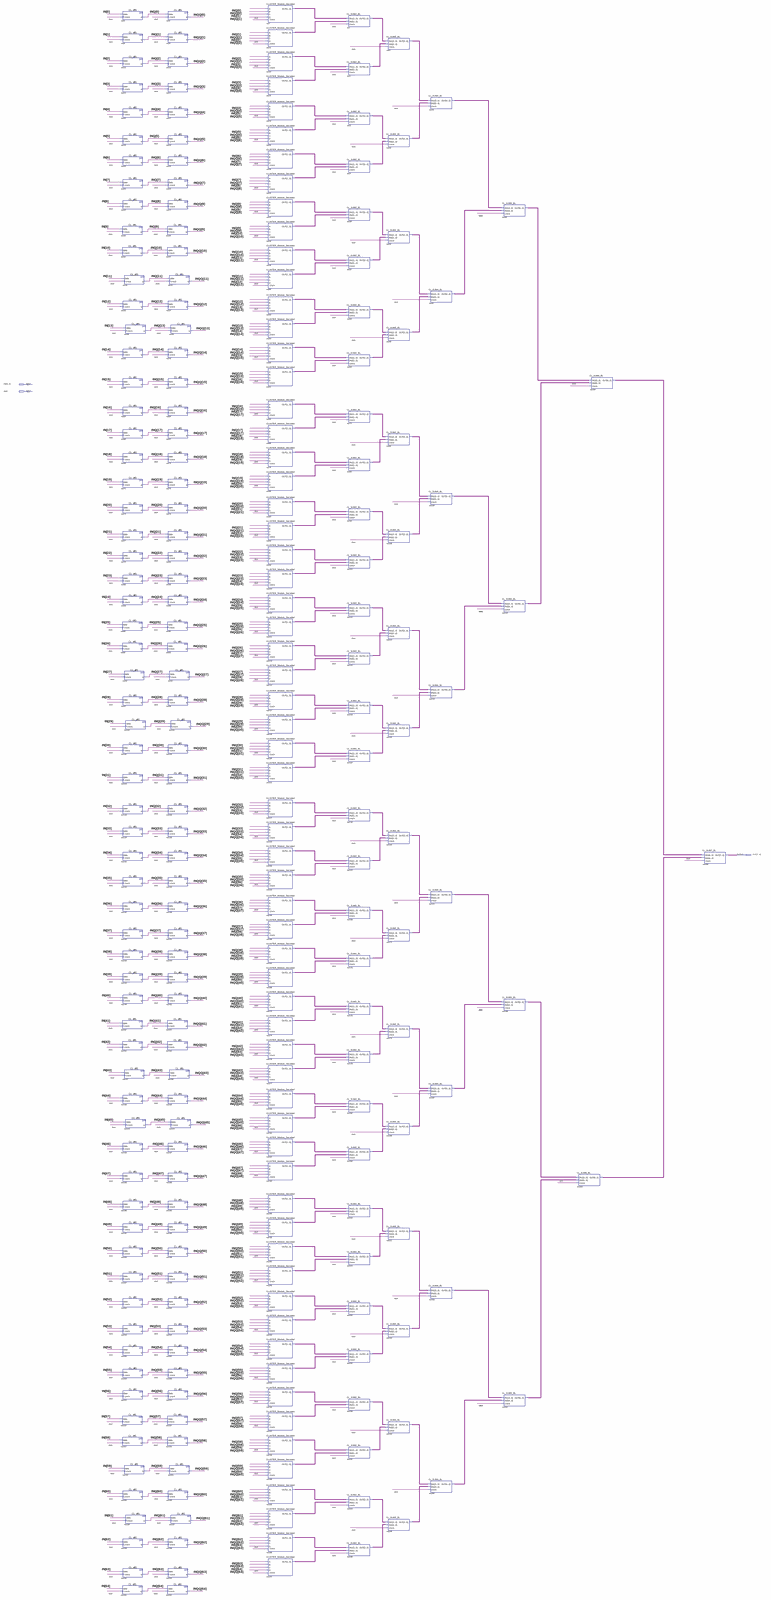
[diagram p0: schematic sheet, whole]
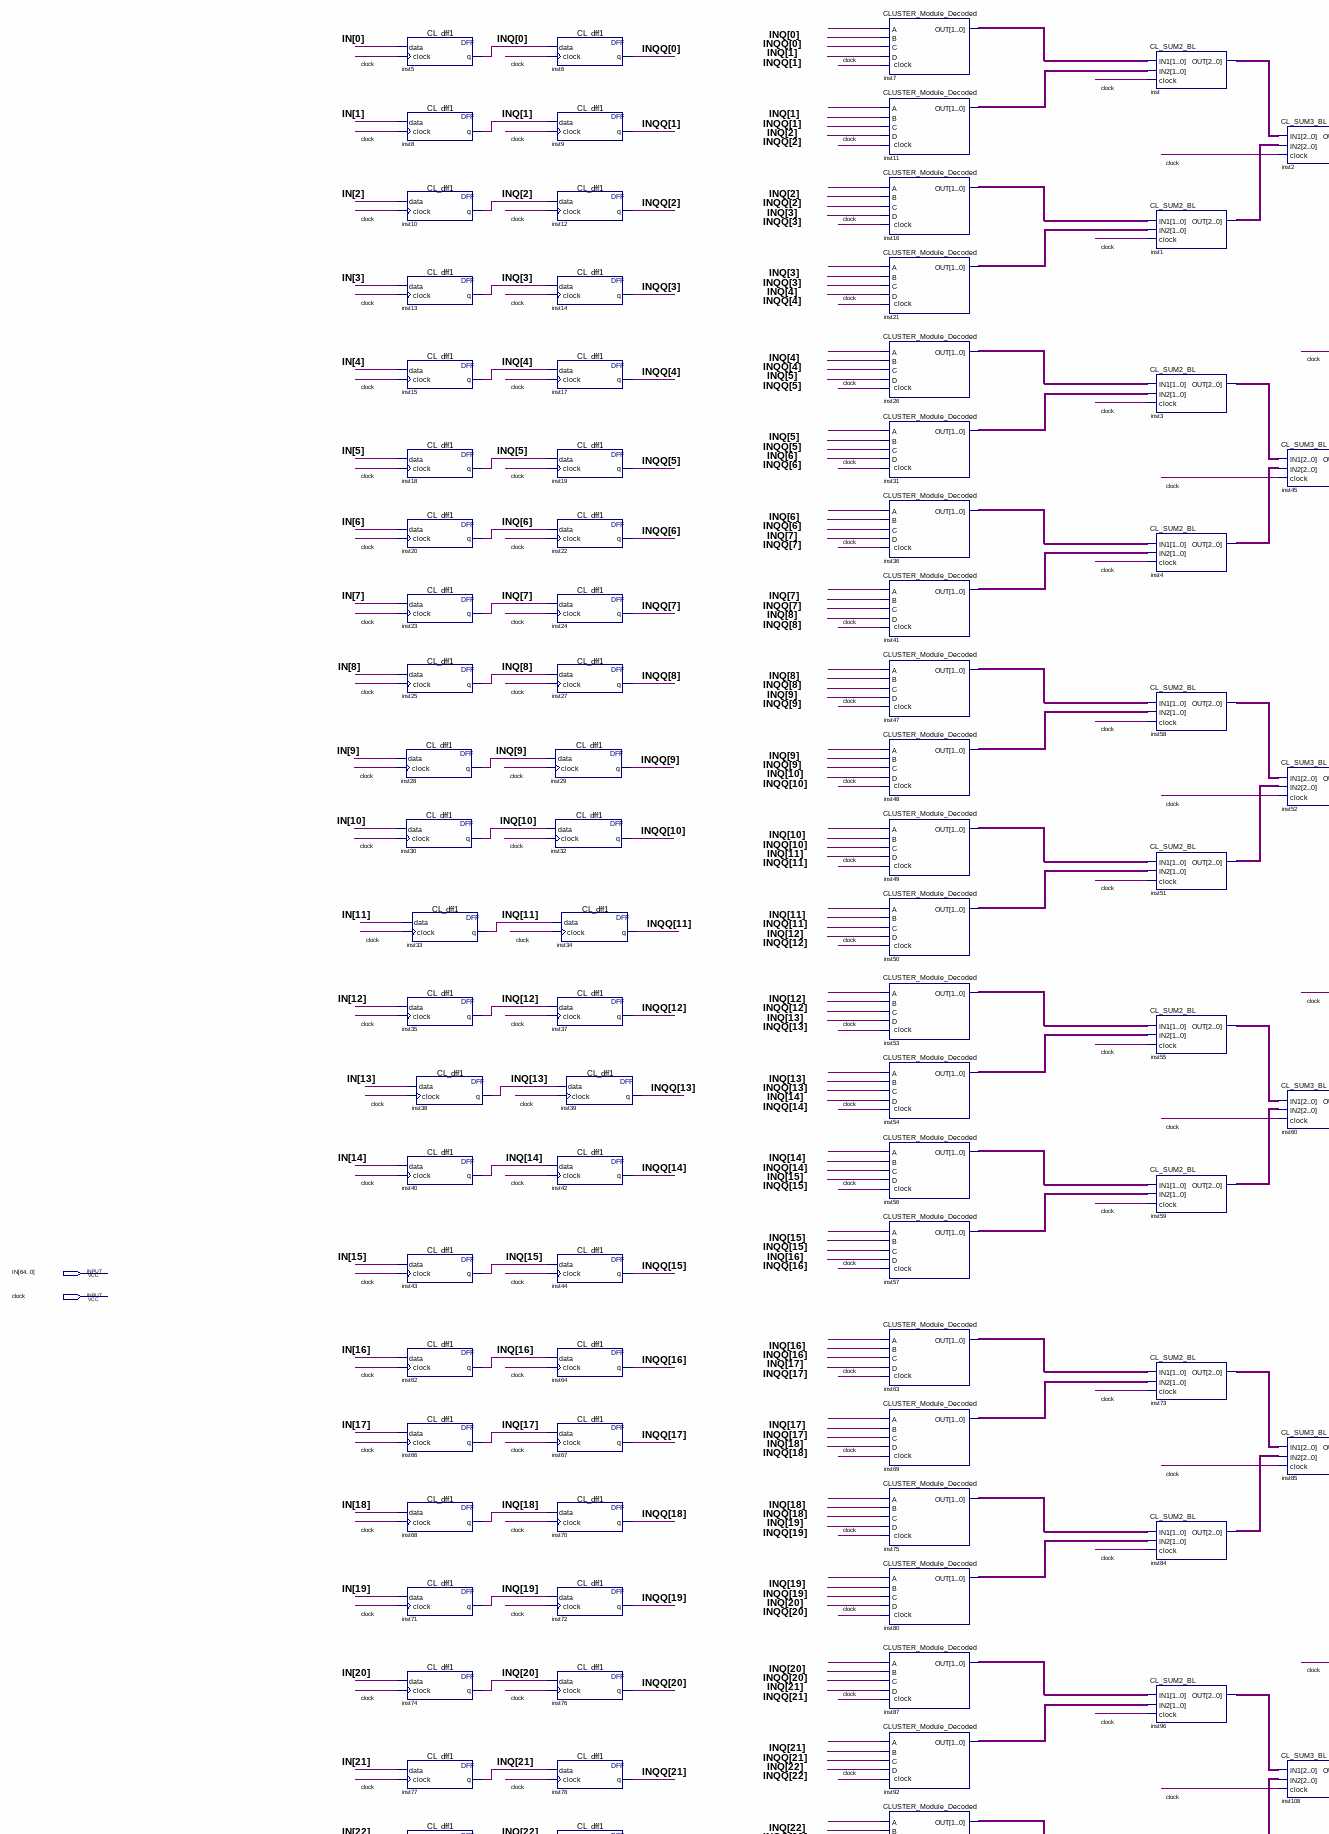
[diagram p1: schematic sheet, upper left part]
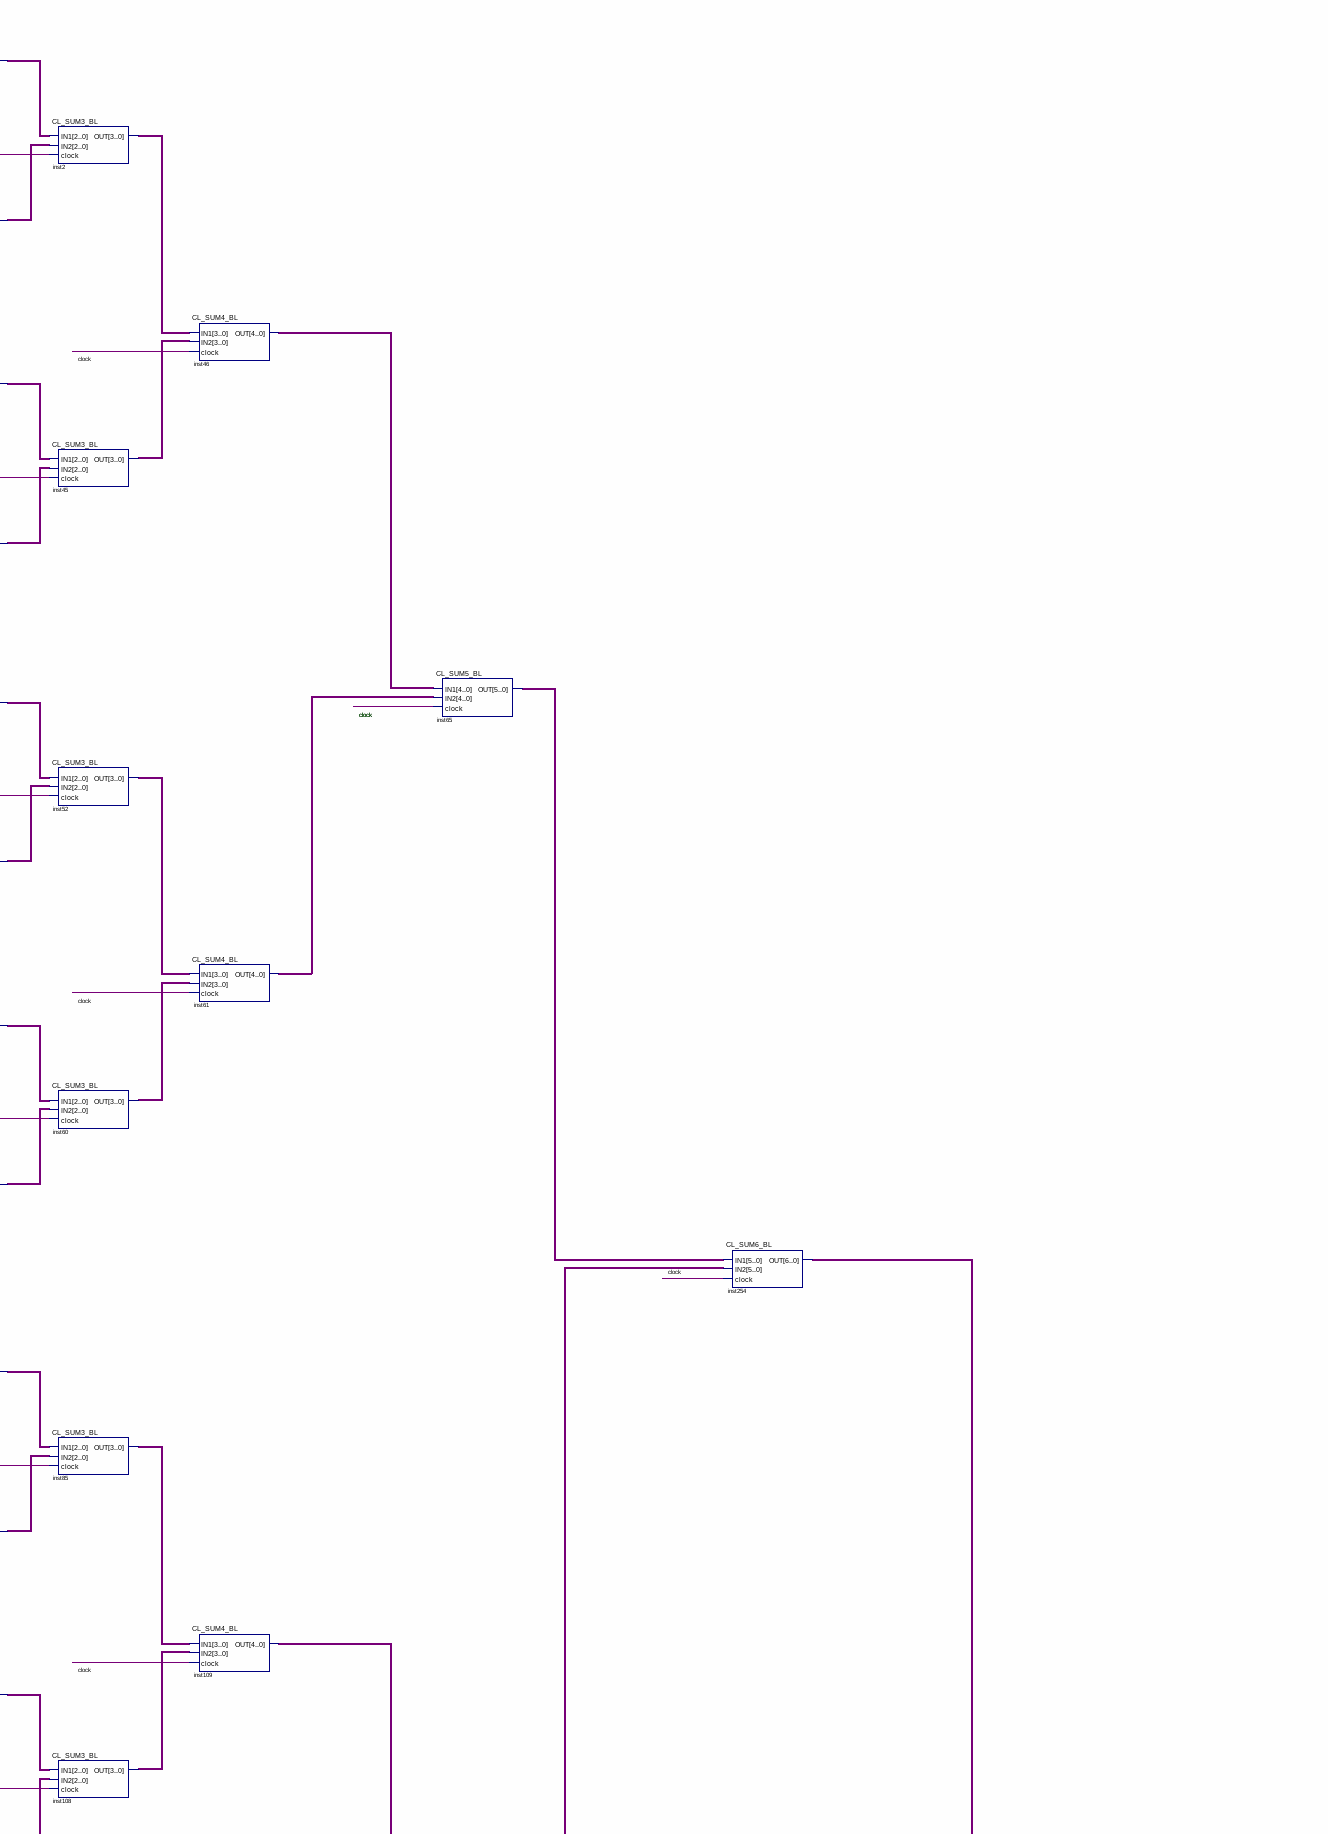
[diagram p2: schematic sheet, upper right part]
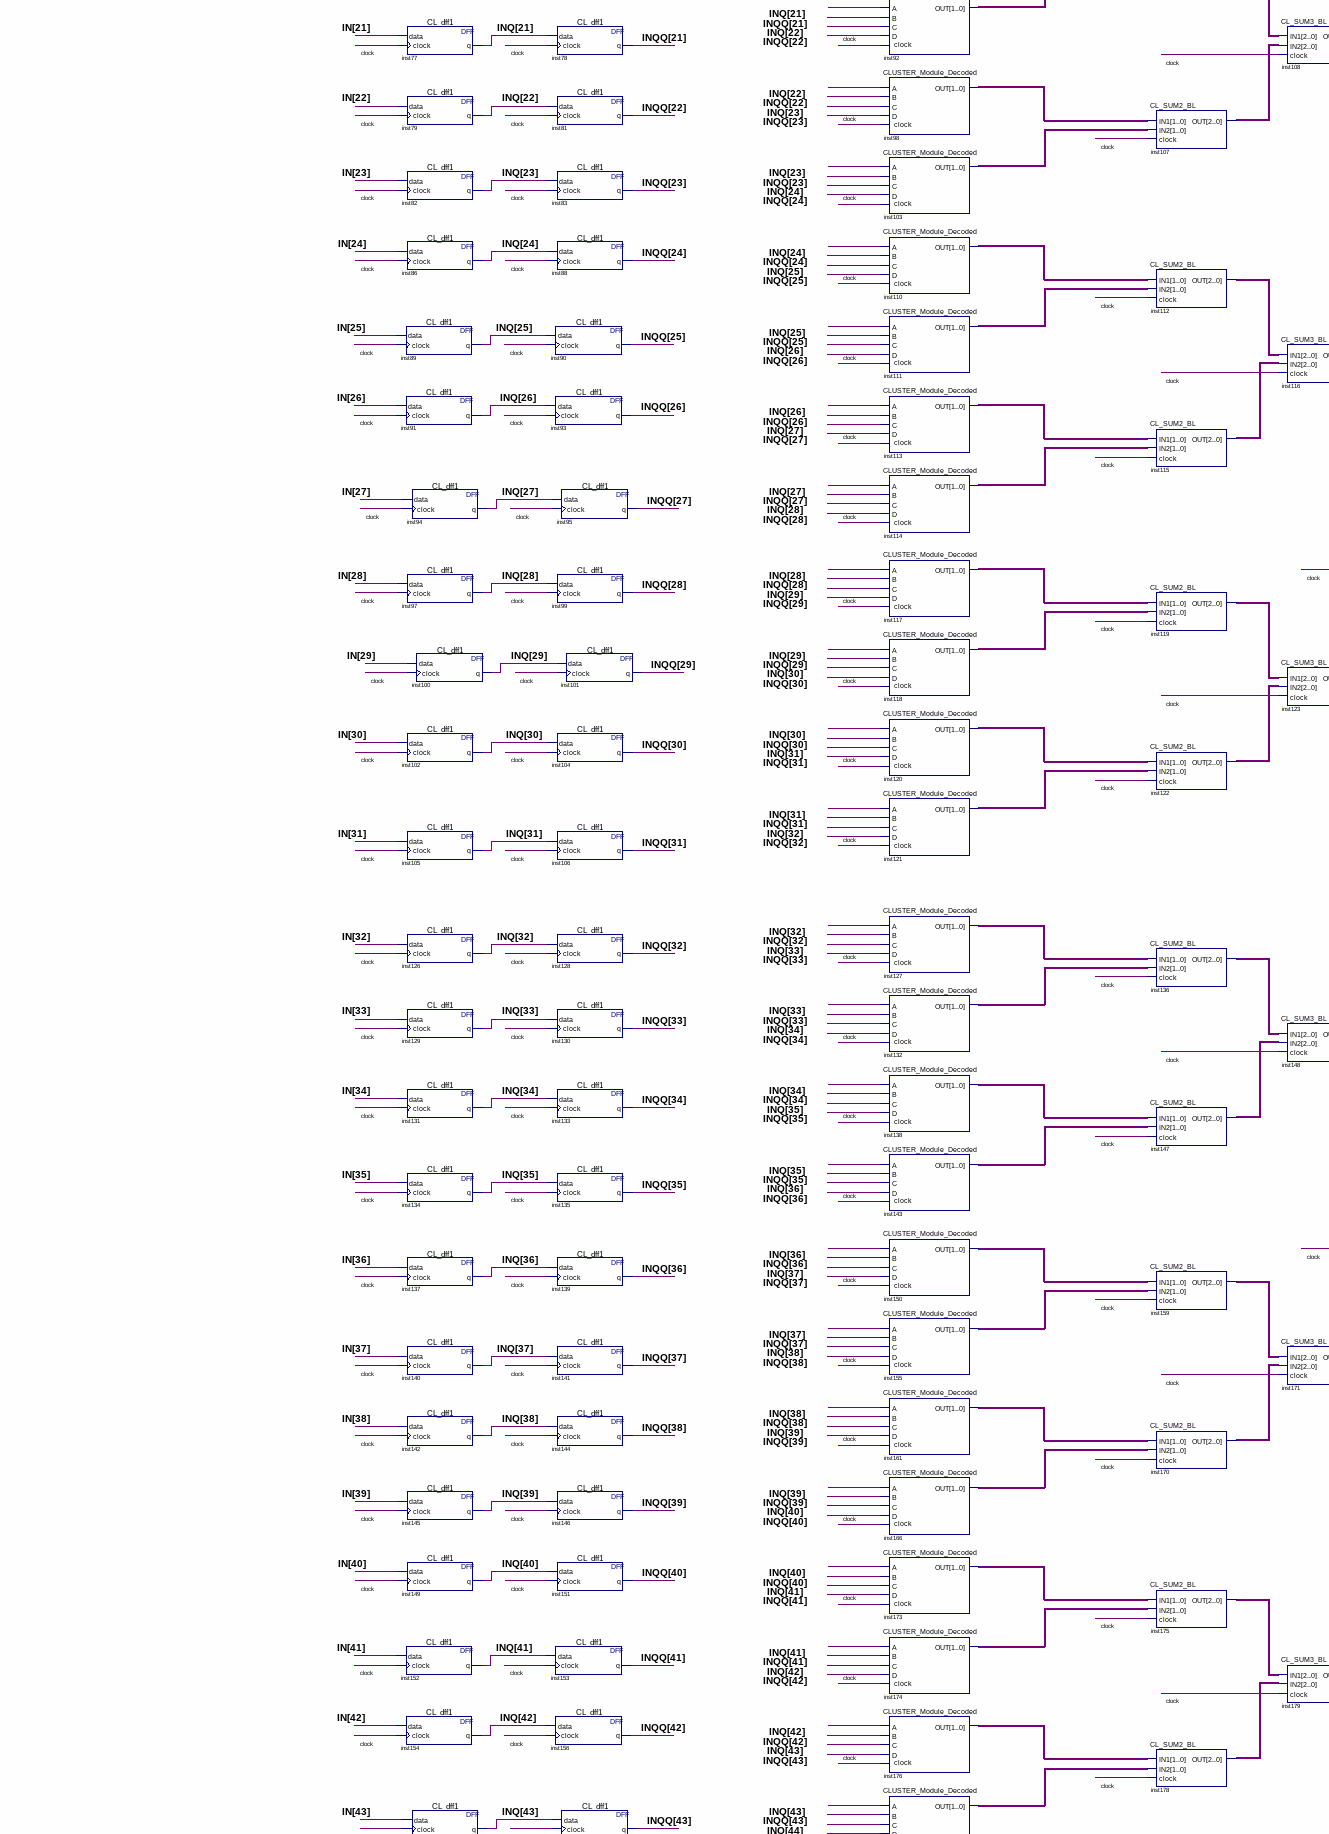
[diagram p3: schematic sheet, middle left part]
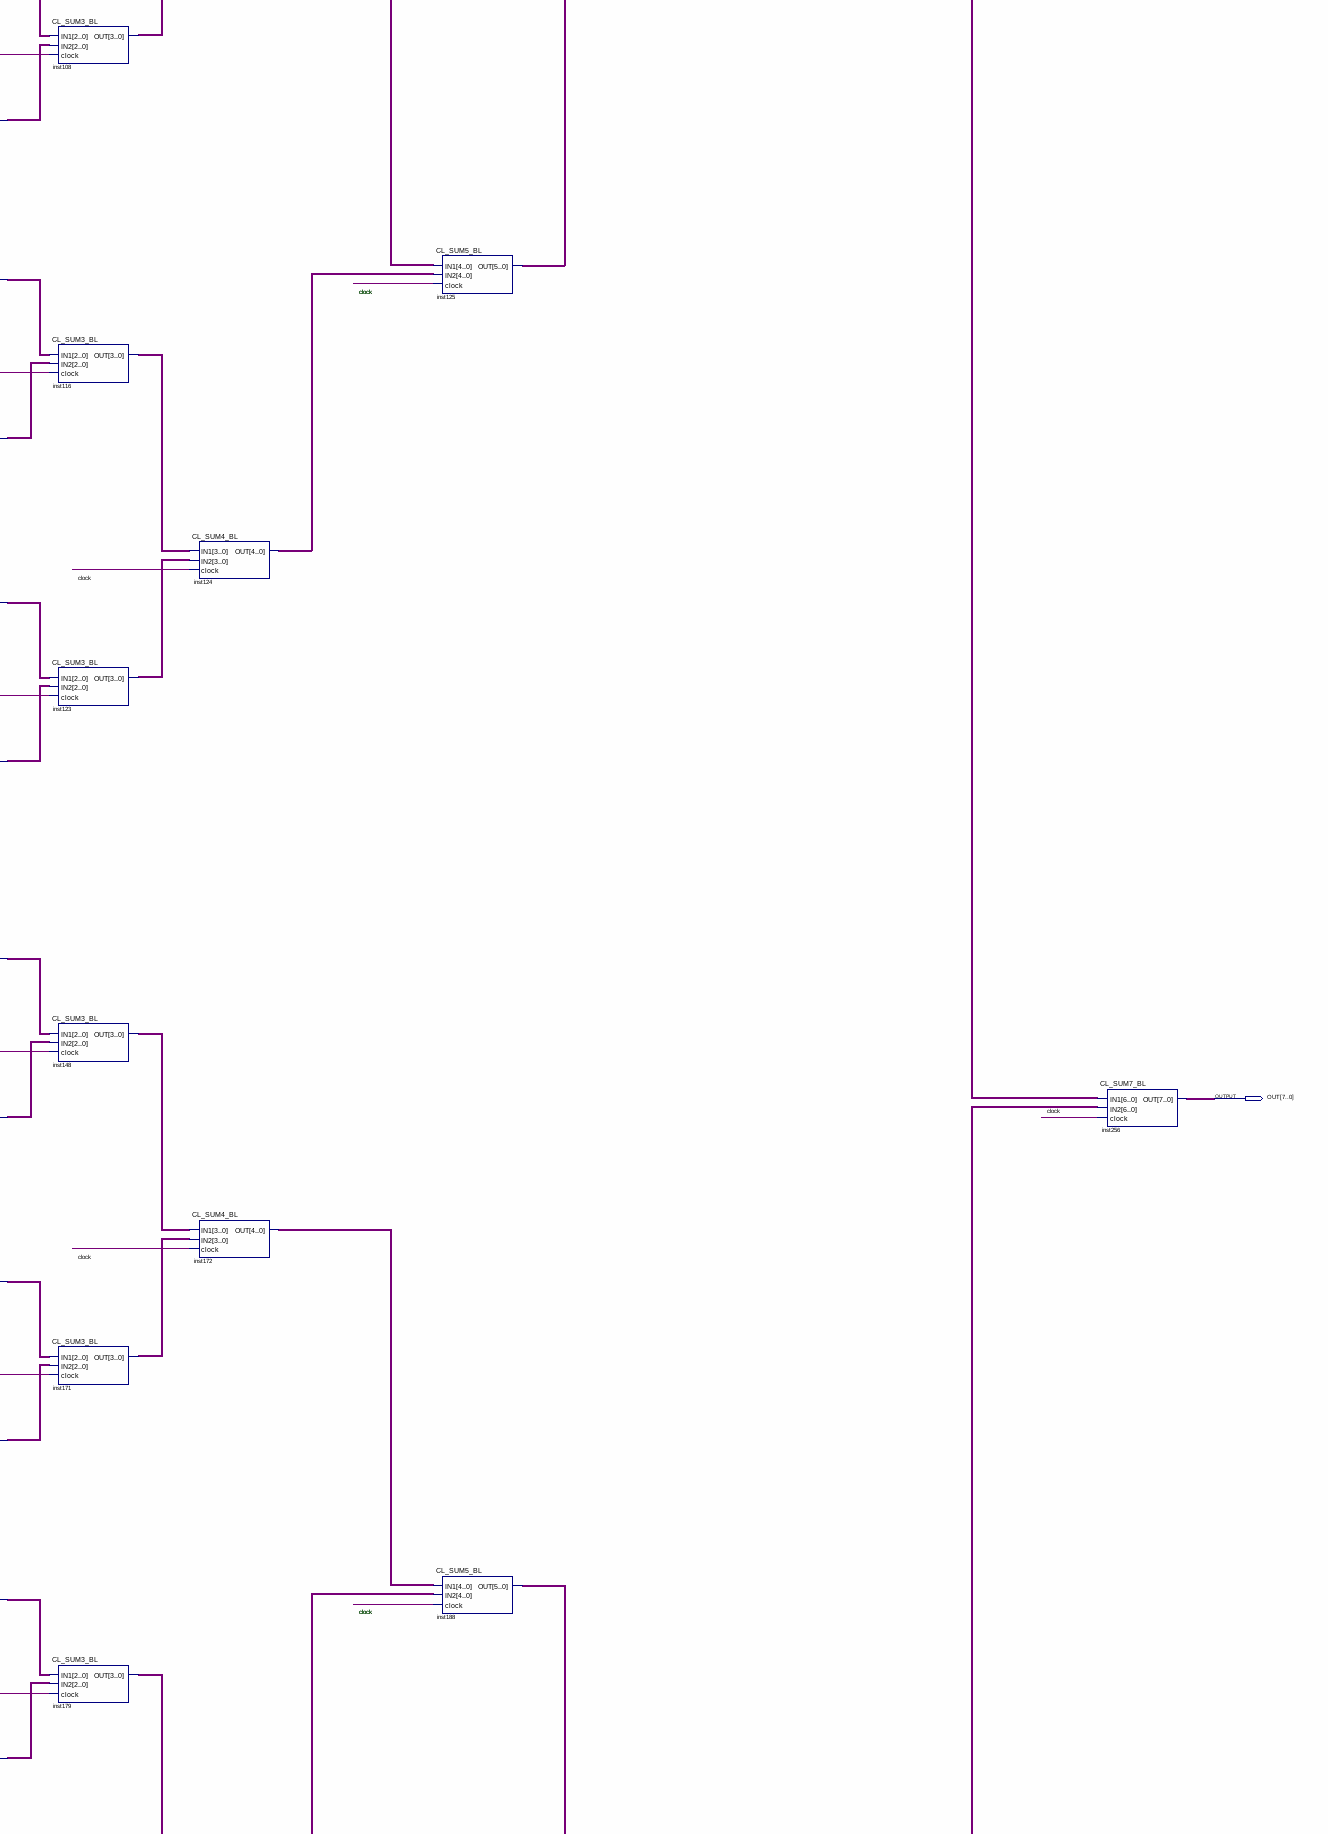
[diagram p4: schematic sheet, middle right part]
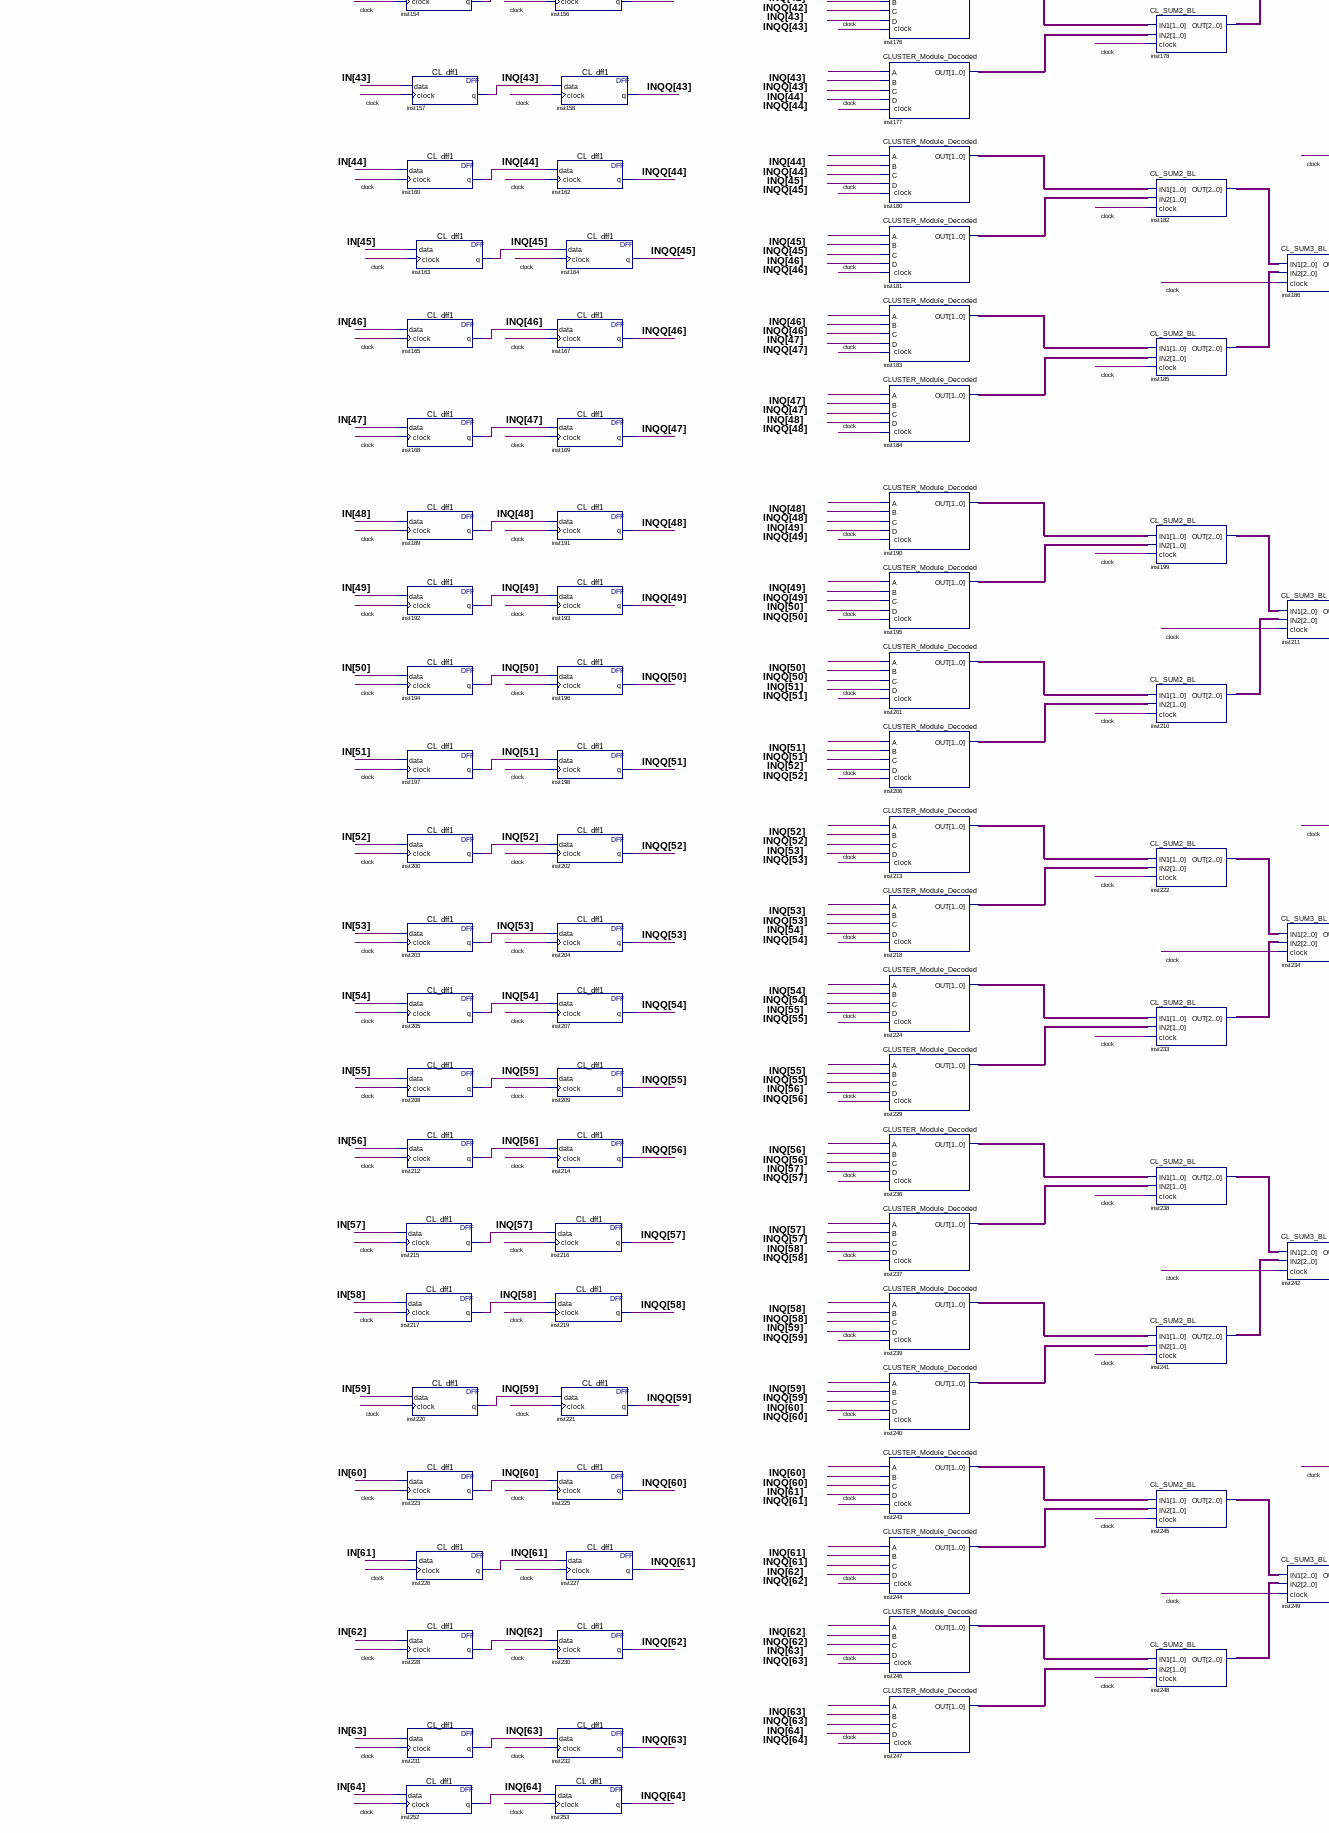
[diagram p5: schematic sheet, lower left part]
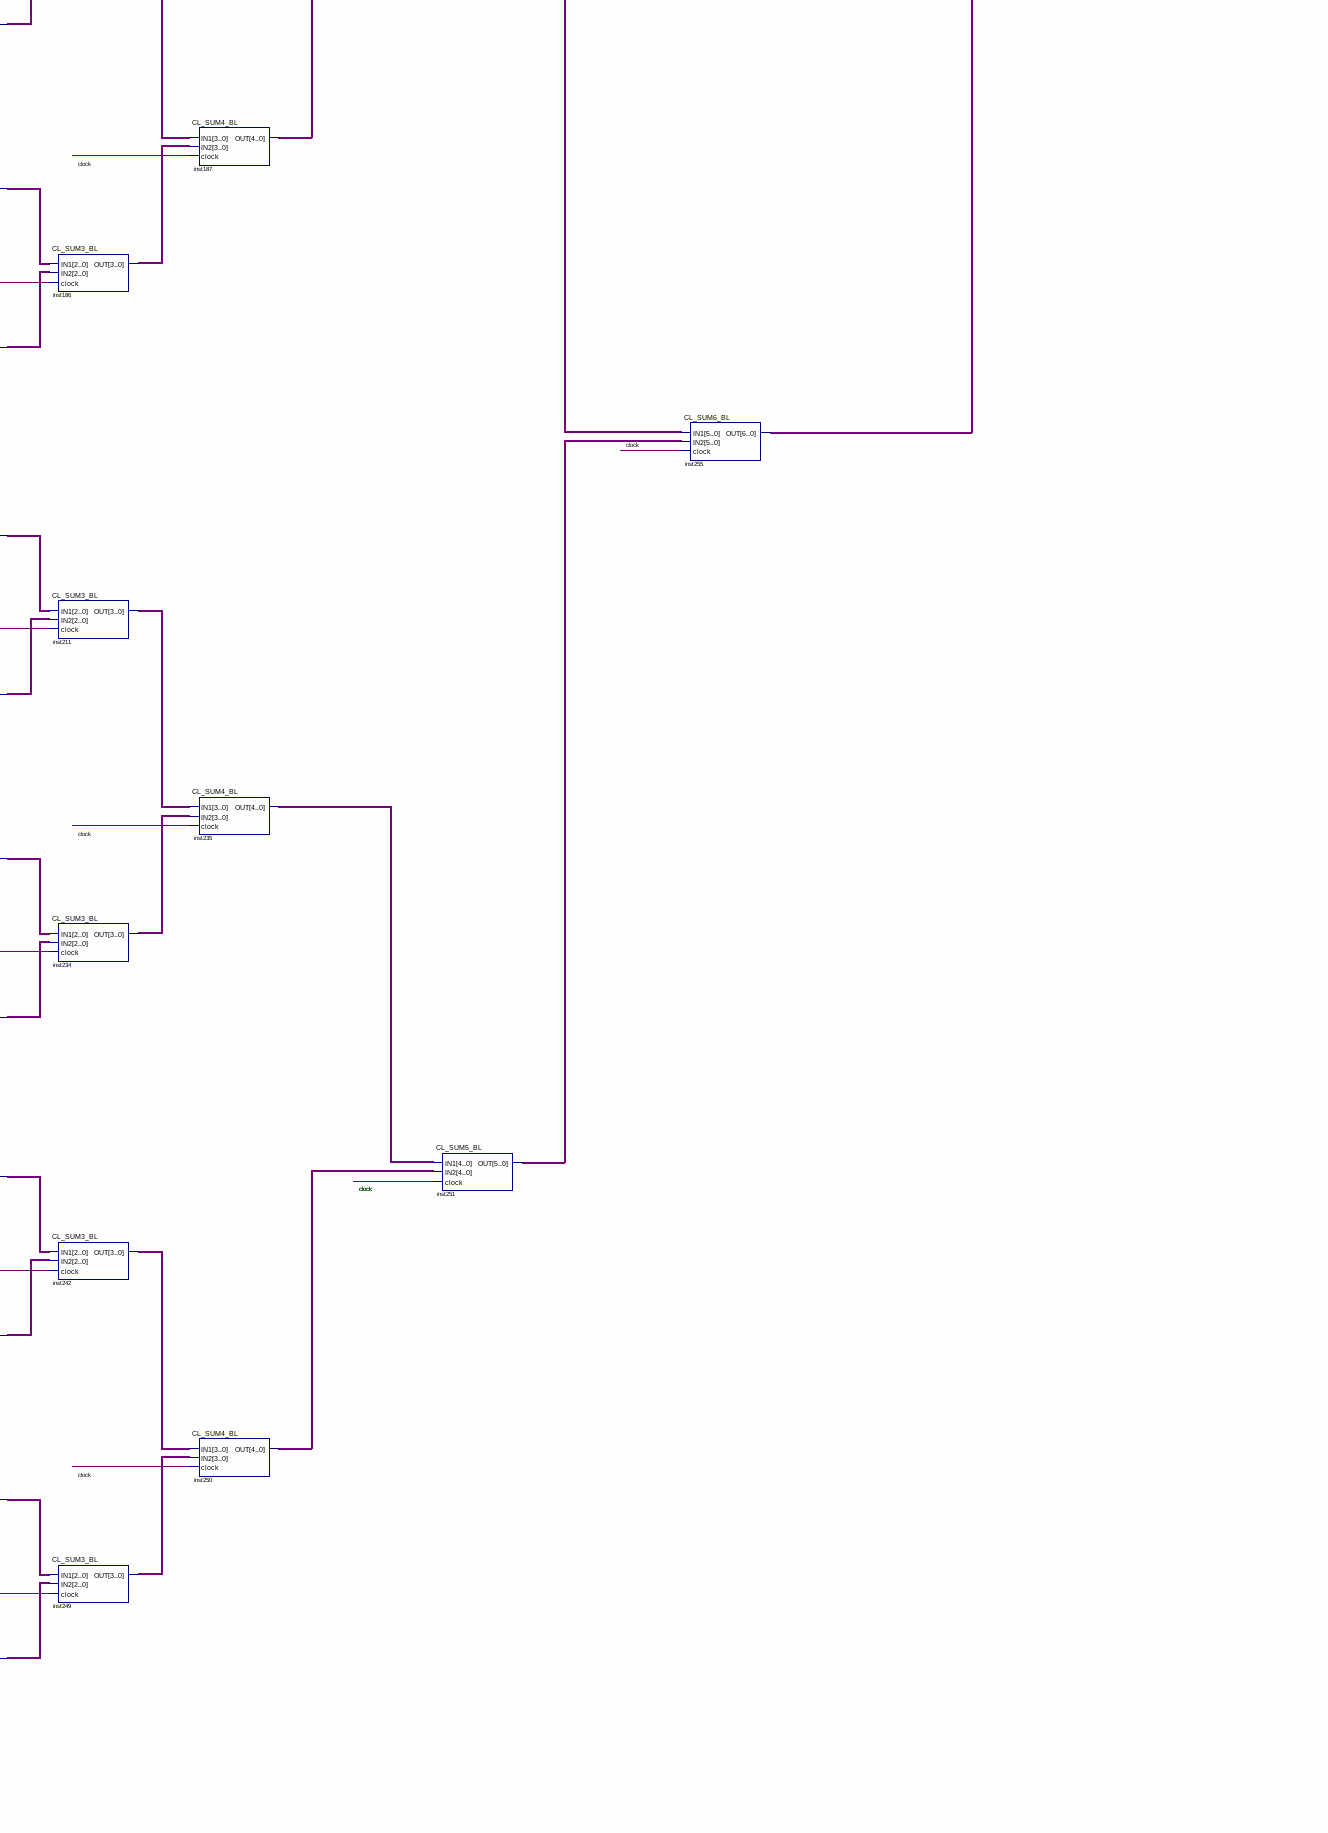
[diagram p6: schematic sheet, lower right part]
// Quartus schematic CL_ClusterCounter_64.bdf as structural Verilog: 257 symbols, 3 pins
module CL_ClusterCounter_64 (
  input  [64:0] IN,
  input  clock,
  output [7:0] OUT
);

  wire [1:0] inst7_out, inst11_out, inst16_out, inst21_out, inst26_out, inst31_out, inst36_out, inst41_out,
       inst47_out, inst48_out, inst49_out, inst50_out, inst53_out, inst54_out, inst56_out, inst57_out,
       inst63_out, inst69_out, inst75_out, inst80_out, inst87_out, inst92_out, inst98_out, inst103_out,
       inst110_out, inst111_out, inst113_out, inst114_out, inst117_out, inst118_out, inst120_out,
       inst121_out, inst127_out, inst132_out, inst138_out, inst143_out, inst150_out, inst155_out,
       inst161_out, inst166_out, inst173_out, inst174_out, inst176_out, inst177_out, inst180_out,
       inst181_out, inst183_out, inst184_out, inst190_out, inst195_out, inst201_out, inst206_out,
       inst213_out, inst218_out, inst224_out, inst229_out, inst236_out, inst237_out, inst239_out,
       inst240_out, inst243_out, inst244_out, inst246_out, inst247_out;
  wire [2:0] inst1_out, inst3_out, inst4_out, inst51_out, inst55_out, inst58_out, inst59_out, inst73_out,
       inst84_out, inst96_out, inst107_out, inst112_out, inst115_out, inst119_out, inst122_out, inst136_out,
       inst147_out, inst159_out, inst170_out, inst175_out, inst178_out, inst182_out, inst185_out,
       inst199_out, inst210_out, inst222_out, inst233_out, inst238_out, inst241_out, inst245_out,
       inst248_out, inst_out;
  wire [3:0] inst2_out, inst45_out, inst52_out, inst60_out, inst85_out, inst108_out, inst116_out,
       inst123_out, inst148_out, inst171_out, inst179_out, inst186_out, inst211_out, inst234_out,
       inst242_out, inst249_out;
  wire [4:0] inst46_out, inst61_out, inst109_out, inst124_out, inst172_out, inst187_out, inst235_out,
       inst250_out;
  wire [5:0] inst65_out, inst125_out, inst188_out, inst251_out;
  wire [6:0] inst254_out, inst255_out;
  wire [64:0] INQ, INQQ;

  CL_dff1 inst28 (.data(IN[9]), .clock(clock), .q(INQ[9]));
  CL_dff1 inst30 (.data(IN[10]), .clock(clock), .q(INQ[10]));
  CL_dff1 inst89 (.data(IN[25]), .clock(clock), .q(INQ[25]));
  CL_dff1 inst91 (.data(IN[26]), .clock(clock), .q(INQ[26]));
  CL_dff1 inst152 (.data(IN[41]), .clock(clock), .q(INQ[41]));
  CL_dff1 inst154 (.data(IN[42]), .clock(clock), .q(INQ[42]));
  CL_dff1 inst215 (.data(IN[57]), .clock(clock), .q(INQ[57]));
  CL_dff1 inst217 (.data(IN[58]), .clock(clock), .q(INQ[58]));
  CL_dff1 inst252 (.data(IN[64]), .clock(clock), .q(INQ[64]));
  CL_dff1 inst5 (.data(IN[0]), .clock(clock), .q(INQ[0]));
  CL_dff1 inst8 (.data(IN[1]), .clock(clock), .q(INQ[1]));
  CL_dff1 inst10 (.data(IN[2]), .clock(clock), .q(INQ[2]));
  CL_dff1 inst13 (.data(IN[3]), .clock(clock), .q(INQ[3]));
  CL_dff1 inst15 (.data(IN[4]), .clock(clock), .q(INQ[4]));
  CL_dff1 inst18 (.data(IN[5]), .clock(clock), .q(INQ[5]));
  CL_dff1 inst20 (.data(IN[6]), .clock(clock), .q(INQ[6]));
  CL_dff1 inst23 (.data(IN[7]), .clock(clock), .q(INQ[7]));
  CL_dff1 inst25 (.data(IN[8]), .clock(clock), .q(INQ[8]));
  CL_dff1 inst33 (.data(IN[11]), .clock(clock), .q(INQ[11]));
  CL_dff1 inst35 (.data(IN[12]), .clock(clock), .q(INQ[12]));
  CL_dff1 inst38 (.data(IN[13]), .clock(clock), .q(INQ[13]));
  CL_dff1 inst40 (.data(IN[14]), .clock(clock), .q(INQ[14]));
  CL_dff1 inst43 (.data(IN[15]), .clock(clock), .q(INQ[15]));
  CL_dff1 inst62 (.data(IN[16]), .clock(clock), .q(INQ[16]));
  CL_dff1 inst66 (.data(IN[17]), .clock(clock), .q(INQ[17]));
  CL_dff1 inst68 (.data(IN[18]), .clock(clock), .q(INQ[18]));
  CL_dff1 inst71 (.data(IN[19]), .clock(clock), .q(INQ[19]));
  CL_dff1 inst74 (.data(IN[20]), .clock(clock), .q(INQ[20]));
  CL_dff1 inst77 (.data(IN[21]), .clock(clock), .q(INQ[21]));
  CL_dff1 inst79 (.data(IN[22]), .clock(clock), .q(INQ[22]));
  CL_dff1 inst82 (.data(IN[23]), .clock(clock), .q(INQ[23]));
  CL_dff1 inst86 (.data(IN[24]), .clock(clock), .q(INQ[24]));
  CL_dff1 inst94 (.data(IN[27]), .clock(clock), .q(INQ[27]));
  CL_dff1 inst97 (.data(IN[28]), .clock(clock), .q(INQ[28]));
  CL_dff1 inst100 (.data(IN[29]), .clock(clock), .q(INQ[29]));
  CL_dff1 inst102 (.data(IN[30]), .clock(clock), .q(INQ[30]));
  CL_dff1 inst105 (.data(IN[31]), .clock(clock), .q(INQ[31]));
  CL_dff1 inst126 (.data(IN[32]), .clock(clock), .q(INQ[32]));
  CL_dff1 inst129 (.data(IN[33]), .clock(clock), .q(INQ[33]));
  CL_dff1 inst131 (.data(IN[34]), .clock(clock), .q(INQ[34]));
  CL_dff1 inst134 (.data(IN[35]), .clock(clock), .q(INQ[35]));
  CL_dff1 inst137 (.data(IN[36]), .clock(clock), .q(INQ[36]));
  CL_dff1 inst140 (.data(IN[37]), .clock(clock), .q(INQ[37]));
  CL_dff1 inst142 (.data(IN[38]), .clock(clock), .q(INQ[38]));
  CL_dff1 inst145 (.data(IN[39]), .clock(clock), .q(INQ[39]));
  CL_dff1 inst149 (.data(IN[40]), .clock(clock), .q(INQ[40]));
  CL_dff1 inst157 (.data(IN[43]), .clock(clock), .q(INQ[43]));
  CL_dff1 inst160 (.data(IN[44]), .clock(clock), .q(INQ[44]));
  CL_dff1 inst163 (.data(IN[45]), .clock(clock), .q(INQ[45]));
  CL_dff1 inst165 (.data(IN[46]), .clock(clock), .q(INQ[46]));
  CL_dff1 inst168 (.data(IN[47]), .clock(clock), .q(INQ[47]));
  CL_dff1 inst189 (.data(IN[48]), .clock(clock), .q(INQ[48]));
  CL_dff1 inst192 (.data(IN[49]), .clock(clock), .q(INQ[49]));
  CL_dff1 inst194 (.data(IN[50]), .clock(clock), .q(INQ[50]));
  CL_dff1 inst197 (.data(IN[51]), .clock(clock), .q(INQ[51]));
  CL_dff1 inst200 (.data(IN[52]), .clock(clock), .q(INQ[52]));
  CL_dff1 inst203 (.data(IN[53]), .clock(clock), .q(INQ[53]));
  CL_dff1 inst205 (.data(IN[54]), .clock(clock), .q(INQ[54]));
  CL_dff1 inst208 (.data(IN[55]), .clock(clock), .q(INQ[55]));
  CL_dff1 inst212 (.data(IN[56]), .clock(clock), .q(INQ[56]));
  CL_dff1 inst220 (.data(IN[59]), .clock(clock), .q(INQ[59]));
  CL_dff1 inst223 (.data(IN[60]), .clock(clock), .q(INQ[60]));
  CL_dff1 inst226 (.data(IN[61]), .clock(clock), .q(INQ[61]));
  CL_dff1 inst228 (.data(IN[62]), .clock(clock), .q(INQ[62]));
  CL_dff1 inst231 (.data(IN[63]), .clock(clock), .q(INQ[63]));
  CL_dff1 inst29 (.data(INQ[9]), .clock(clock), .q(INQQ[9]));
  CL_dff1 inst32 (.data(INQ[10]), .clock(clock), .q(INQQ[10]));
  CL_dff1 inst90 (.data(INQ[25]), .clock(clock), .q(INQQ[25]));
  CL_dff1 inst93 (.data(INQ[26]), .clock(clock), .q(INQQ[26]));
  CL_dff1 inst153 (.data(INQ[41]), .clock(clock), .q(INQQ[41]));
  CL_dff1 inst156 (.data(INQ[42]), .clock(clock), .q(INQQ[42]));
  CL_dff1 inst216 (.data(INQ[57]), .clock(clock), .q(INQQ[57]));
  CL_dff1 inst219 (.data(INQ[58]), .clock(clock), .q(INQQ[58]));
  CL_dff1 inst253 (.data(INQ[64]), .clock(clock), .q(INQQ[64]));
  CL_dff1 inst6 (.data(INQ[0]), .clock(clock), .q(INQQ[0]));
  CL_dff1 inst9 (.data(INQ[1]), .clock(clock), .q(INQQ[1]));
  CL_dff1 inst12 (.data(INQ[2]), .clock(clock), .q(INQQ[2]));
  CL_dff1 inst14 (.data(INQ[3]), .clock(clock), .q(INQQ[3]));
  CL_dff1 inst17 (.data(INQ[4]), .clock(clock), .q(INQQ[4]));
  CL_dff1 inst19 (.data(INQ[5]), .clock(clock), .q(INQQ[5]));
  CL_dff1 inst22 (.data(INQ[6]), .clock(clock), .q(INQQ[6]));
  CL_dff1 inst24 (.data(INQ[7]), .clock(clock), .q(INQQ[7]));
  CL_dff1 inst27 (.data(INQ[8]), .clock(clock), .q(INQQ[8]));
  CL_dff1 inst34 (.data(INQ[11]), .clock(clock), .q(INQQ[11]));
  CL_dff1 inst37 (.data(INQ[12]), .clock(clock), .q(INQQ[12]));
  CL_dff1 inst39 (.data(INQ[13]), .clock(clock), .q(INQQ[13]));
  CL_dff1 inst42 (.data(INQ[14]), .clock(clock), .q(INQQ[14]));
  CL_dff1 inst44 (.data(INQ[15]), .clock(clock), .q(INQQ[15]));
  CL_dff1 inst64 (.data(INQ[16]), .clock(clock), .q(INQQ[16]));
  CL_dff1 inst67 (.data(INQ[17]), .clock(clock), .q(INQQ[17]));
  CL_dff1 inst70 (.data(INQ[18]), .clock(clock), .q(INQQ[18]));
  CL_dff1 inst72 (.data(INQ[19]), .clock(clock), .q(INQQ[19]));
  CL_dff1 inst76 (.data(INQ[20]), .clock(clock), .q(INQQ[20]));
  CL_dff1 inst78 (.data(INQ[21]), .clock(clock), .q(INQQ[21]));
  CL_dff1 inst81 (.data(INQ[22]), .clock(clock), .q(INQQ[22]));
  CL_dff1 inst83 (.data(INQ[23]), .clock(clock), .q(INQQ[23]));
  CL_dff1 inst88 (.data(INQ[24]), .clock(clock), .q(INQQ[24]));
  CL_dff1 inst95 (.data(INQ[27]), .clock(clock), .q(INQQ[27]));
  CL_dff1 inst99 (.data(INQ[28]), .clock(clock), .q(INQQ[28]));
  CL_dff1 inst101 (.data(INQ[29]), .clock(clock), .q(INQQ[29]));
  CL_dff1 inst104 (.data(INQ[30]), .clock(clock), .q(INQQ[30]));
  CL_dff1 inst106 (.data(INQ[31]), .clock(clock), .q(INQQ[31]));
  CL_dff1 inst128 (.data(INQ[32]), .clock(clock), .q(INQQ[32]));
  CL_dff1 inst130 (.data(INQ[33]), .clock(clock), .q(INQQ[33]));
  CL_dff1 inst133 (.data(INQ[34]), .clock(clock), .q(INQQ[34]));
  CL_dff1 inst135 (.data(INQ[35]), .clock(clock), .q(INQQ[35]));
  CL_dff1 inst139 (.data(INQ[36]), .clock(clock), .q(INQQ[36]));
  CL_dff1 inst141 (.data(INQ[37]), .clock(clock), .q(INQQ[37]));
  CL_dff1 inst144 (.data(INQ[38]), .clock(clock), .q(INQQ[38]));
  CL_dff1 inst146 (.data(INQ[39]), .clock(clock), .q(INQQ[39]));
  CL_dff1 inst151 (.data(INQ[40]), .clock(clock), .q(INQQ[40]));
  CL_dff1 inst158 (.data(INQ[43]), .clock(clock), .q(INQQ[43]));
  CL_dff1 inst162 (.data(INQ[44]), .clock(clock), .q(INQQ[44]));
  CL_dff1 inst164 (.data(INQ[45]), .clock(clock), .q(INQQ[45]));
  CL_dff1 inst167 (.data(INQ[46]), .clock(clock), .q(INQQ[46]));
  CL_dff1 inst169 (.data(INQ[47]), .clock(clock), .q(INQQ[47]));
  CL_dff1 inst191 (.data(INQ[48]), .clock(clock), .q(INQQ[48]));
  CL_dff1 inst193 (.data(INQ[49]), .clock(clock), .q(INQQ[49]));
  CL_dff1 inst196 (.data(INQ[50]), .clock(clock), .q(INQQ[50]));
  CL_dff1 inst198 (.data(INQ[51]), .clock(clock), .q(INQQ[51]));
  CL_dff1 inst202 (.data(INQ[52]), .clock(clock), .q(INQQ[52]));
  CL_dff1 inst204 (.data(INQ[53]), .clock(clock), .q(INQQ[53]));
  CL_dff1 inst207 (.data(INQ[54]), .clock(clock), .q(INQQ[54]));
  CL_dff1 inst209 (.data(INQ[55]), .clock(clock), .q(INQQ[55]));
  CL_dff1 inst214 (.data(INQ[56]), .clock(clock), .q(INQQ[56]));
  CL_dff1 inst221 (.data(INQ[59]), .clock(clock), .q(INQQ[59]));
  CL_dff1 inst225 (.data(INQ[60]), .clock(clock), .q(INQQ[60]));
  CL_dff1 inst227 (.data(INQ[61]), .clock(clock), .q(INQQ[61]));
  CL_dff1 inst230 (.data(INQ[62]), .clock(clock), .q(INQQ[62]));
  CL_dff1 inst232 (.data(INQ[63]), .clock(clock), .q(INQQ[63]));
  CLUSTER_Module_Decoded inst7 (.A(INQ[0]), .B(INQQ[0]), .C(INQ[1]), .D(INQQ[1]), .clock(clock), .OUT(inst7_out));
  CLUSTER_Module_Decoded inst11 (.A(INQ[1]), .B(INQQ[1]), .C(INQ[2]), .D(INQQ[2]), .clock(clock), .OUT(inst11_out));
  CLUSTER_Module_Decoded inst16 (.A(INQ[2]), .B(INQQ[2]), .C(INQ[3]), .D(INQQ[3]), .clock(clock), .OUT(inst16_out));
  CLUSTER_Module_Decoded inst21 (.A(INQ[3]), .B(INQQ[3]), .C(INQ[4]), .D(INQQ[4]), .clock(clock), .OUT(inst21_out));
  CLUSTER_Module_Decoded inst26 (.A(INQ[4]), .B(INQQ[4]), .C(INQ[5]), .D(INQQ[5]), .clock(clock), .OUT(inst26_out));
  CLUSTER_Module_Decoded inst31 (.A(INQ[5]), .B(INQQ[5]), .C(INQ[6]), .D(INQQ[6]), .clock(clock), .OUT(inst31_out));
  CLUSTER_Module_Decoded inst36 (.A(INQ[6]), .B(INQQ[6]), .C(INQ[7]), .D(INQQ[7]), .clock(clock), .OUT(inst36_out));
  CLUSTER_Module_Decoded inst41 (.A(INQ[7]), .B(INQQ[7]), .C(INQ[8]), .D(INQQ[8]), .clock(clock), .OUT(inst41_out));
  CLUSTER_Module_Decoded inst47 (.A(INQ[8]), .B(INQQ[8]), .C(INQ[9]), .D(INQQ[9]), .clock(clock), .OUT(inst47_out));
  CLUSTER_Module_Decoded inst48 (.A(INQ[9]), .B(INQQ[9]), .C(INQ[10]), .D(INQQ[10]), .clock(clock), .OUT(inst48_out));
  CLUSTER_Module_Decoded inst49 (.A(INQ[10]), .B(INQQ[10]), .C(INQ[11]), .D(INQQ[11]), .clock(clock), .OUT(inst49_out));
  CLUSTER_Module_Decoded inst50 (.A(INQ[11]), .B(INQQ[11]), .C(INQ[12]), .D(INQQ[12]), .clock(clock), .OUT(inst50_out));
  CLUSTER_Module_Decoded inst53 (.A(INQ[12]), .B(INQQ[12]), .C(INQ[13]), .D(INQQ[13]), .clock(clock), .OUT(inst53_out));
  CLUSTER_Module_Decoded inst54 (.A(INQ[13]), .B(INQQ[13]), .C(INQ[14]), .D(INQQ[14]), .clock(clock), .OUT(inst54_out));
  CLUSTER_Module_Decoded inst56 (.A(INQ[14]), .B(INQQ[14]), .C(INQ[15]), .D(INQQ[15]), .clock(clock), .OUT(inst56_out));
  CLUSTER_Module_Decoded inst57 (.A(INQ[15]), .B(INQQ[15]), .C(INQ[16]), .D(INQQ[16]), .clock(clock), .OUT(inst57_out));
  CLUSTER_Module_Decoded inst63 (.A(INQ[16]), .B(INQQ[16]), .C(INQ[17]), .D(INQQ[17]), .clock(clock), .OUT(inst63_out));
  CLUSTER_Module_Decoded inst69 (.A(INQ[17]), .B(INQQ[17]), .C(INQ[18]), .D(INQQ[18]), .clock(clock), .OUT(inst69_out));
  CLUSTER_Module_Decoded inst75 (.A(INQ[18]), .B(INQQ[18]), .C(INQ[19]), .D(INQQ[19]), .clock(clock), .OUT(inst75_out));
  CLUSTER_Module_Decoded inst80 (.A(INQ[19]), .B(INQQ[19]), .C(INQ[20]), .D(INQQ[20]), .clock(clock), .OUT(inst80_out));
  CLUSTER_Module_Decoded inst87 (.A(INQ[20]), .B(INQQ[20]), .C(INQ[21]), .D(INQQ[21]), .clock(clock), .OUT(inst87_out));
  CLUSTER_Module_Decoded inst92 (.A(INQ[21]), .B(INQQ[21]), .C(INQ[22]), .D(INQQ[22]), .clock(clock), .OUT(inst92_out));
  CLUSTER_Module_Decoded inst98 (.A(INQ[22]), .B(INQQ[22]), .C(INQ[23]), .D(INQQ[23]), .clock(clock), .OUT(inst98_out));
  CLUSTER_Module_Decoded inst103 (
    .A(INQ[23]), .B(INQQ[23]), .C(INQ[24]), .D(INQQ[24]), .clock(clock), .OUT(inst103_out));
  CLUSTER_Module_Decoded inst110 (
    .A(INQ[24]), .B(INQQ[24]), .C(INQ[25]), .D(INQQ[25]), .clock(clock), .OUT(inst110_out));
  CLUSTER_Module_Decoded inst111 (
    .A(INQ[25]), .B(INQQ[25]), .C(INQ[26]), .D(INQQ[26]), .clock(clock), .OUT(inst111_out));
  CLUSTER_Module_Decoded inst113 (
    .A(INQ[26]), .B(INQQ[26]), .C(INQ[27]), .D(INQQ[27]), .clock(clock), .OUT(inst113_out));
  CLUSTER_Module_Decoded inst114 (
    .A(INQ[27]), .B(INQQ[27]), .C(INQ[28]), .D(INQQ[28]), .clock(clock), .OUT(inst114_out));
  CLUSTER_Module_Decoded inst117 (
    .A(INQ[28]), .B(INQQ[28]), .C(INQ[29]), .D(INQQ[29]), .clock(clock), .OUT(inst117_out));
  CLUSTER_Module_Decoded inst118 (
    .A(INQ[29]), .B(INQQ[29]), .C(INQ[30]), .D(INQQ[30]), .clock(clock), .OUT(inst118_out));
  CLUSTER_Module_Decoded inst120 (
    .A(INQ[30]), .B(INQQ[30]), .C(INQ[31]), .D(INQQ[31]), .clock(clock), .OUT(inst120_out));
  CLUSTER_Module_Decoded inst121 (
    .A(INQ[31]), .B(INQQ[31]), .C(INQ[32]), .D(INQQ[32]), .clock(clock), .OUT(inst121_out));
  CLUSTER_Module_Decoded inst127 (
    .A(INQ[32]), .B(INQQ[32]), .C(INQ[33]), .D(INQQ[33]), .clock(clock), .OUT(inst127_out));
  CLUSTER_Module_Decoded inst132 (
    .A(INQ[33]), .B(INQQ[33]), .C(INQ[34]), .D(INQQ[34]), .clock(clock), .OUT(inst132_out));
  CLUSTER_Module_Decoded inst138 (
    .A(INQ[34]), .B(INQQ[34]), .C(INQ[35]), .D(INQQ[35]), .clock(clock), .OUT(inst138_out));
  CLUSTER_Module_Decoded inst143 (
    .A(INQ[35]), .B(INQQ[35]), .C(INQ[36]), .D(INQQ[36]), .clock(clock), .OUT(inst143_out));
  CLUSTER_Module_Decoded inst150 (
    .A(INQ[36]), .B(INQQ[36]), .C(INQ[37]), .D(INQQ[37]), .clock(clock), .OUT(inst150_out));
  CLUSTER_Module_Decoded inst155 (
    .A(INQ[37]), .B(INQQ[37]), .C(INQ[38]), .D(INQQ[38]), .clock(clock), .OUT(inst155_out));
  CLUSTER_Module_Decoded inst161 (
    .A(INQ[38]), .B(INQQ[38]), .C(INQ[39]), .D(INQQ[39]), .clock(clock), .OUT(inst161_out));
  CLUSTER_Module_Decoded inst166 (
    .A(INQ[39]), .B(INQQ[39]), .C(INQ[40]), .D(INQQ[40]), .clock(clock), .OUT(inst166_out));
  CLUSTER_Module_Decoded inst173 (
    .A(INQ[40]), .B(INQQ[40]), .C(INQ[41]), .D(INQQ[41]), .clock(clock), .OUT(inst173_out));
  CLUSTER_Module_Decoded inst174 (
    .A(INQ[41]), .B(INQQ[41]), .C(INQ[42]), .D(INQQ[42]), .clock(clock), .OUT(inst174_out));
  CLUSTER_Module_Decoded inst176 (
    .A(INQ[42]), .B(INQQ[42]), .C(INQ[43]), .D(INQQ[43]), .clock(clock), .OUT(inst176_out));
  CLUSTER_Module_Decoded inst177 (
    .A(INQ[43]), .B(INQQ[43]), .C(INQ[44]), .D(INQQ[44]), .clock(clock), .OUT(inst177_out));
  CLUSTER_Module_Decoded inst180 (
    .A(INQ[44]), .B(INQQ[44]), .C(INQ[45]), .D(INQQ[45]), .clock(clock), .OUT(inst180_out));
  CLUSTER_Module_Decoded inst181 (
    .A(INQ[45]), .B(INQQ[45]), .C(INQ[46]), .D(INQQ[46]), .clock(clock), .OUT(inst181_out));
  CLUSTER_Module_Decoded inst183 (
    .A(INQ[46]), .B(INQQ[46]), .C(INQ[47]), .D(INQQ[47]), .clock(clock), .OUT(inst183_out));
  CLUSTER_Module_Decoded inst184 (
    .A(INQ[47]), .B(INQQ[47]), .C(INQ[48]), .D(INQQ[48]), .clock(clock), .OUT(inst184_out));
  CLUSTER_Module_Decoded inst190 (
    .A(INQ[48]), .B(INQQ[48]), .C(INQ[49]), .D(INQQ[49]), .clock(clock), .OUT(inst190_out));
  CLUSTER_Module_Decoded inst195 (
    .A(INQ[49]), .B(INQQ[49]), .C(INQ[50]), .D(INQQ[50]), .clock(clock), .OUT(inst195_out));
  CLUSTER_Module_Decoded inst201 (
    .A(INQ[50]), .B(INQQ[50]), .C(INQ[51]), .D(INQQ[51]), .clock(clock), .OUT(inst201_out));
  CLUSTER_Module_Decoded inst206 (
    .A(INQ[51]), .B(INQQ[51]), .C(INQ[52]), .D(INQQ[52]), .clock(clock), .OUT(inst206_out));
  CLUSTER_Module_Decoded inst213 (
    .A(INQ[52]), .B(INQQ[52]), .C(INQ[53]), .D(INQQ[53]), .clock(clock), .OUT(inst213_out));
  CLUSTER_Module_Decoded inst218 (
    .A(INQ[53]), .B(INQQ[53]), .C(INQ[54]), .D(INQQ[54]), .clock(clock), .OUT(inst218_out));
  CLUSTER_Module_Decoded inst224 (
    .A(INQ[54]), .B(INQQ[54]), .C(INQ[55]), .D(INQQ[55]), .clock(clock), .OUT(inst224_out));
  CLUSTER_Module_Decoded inst229 (
    .A(INQ[55]), .B(INQQ[55]), .C(INQ[56]), .D(INQQ[56]), .clock(clock), .OUT(inst229_out));
  CLUSTER_Module_Decoded inst236 (
    .A(INQ[56]), .B(INQQ[56]), .C(INQ[57]), .D(INQQ[57]), .clock(clock), .OUT(inst236_out));
  CLUSTER_Module_Decoded inst237 (
    .A(INQ[57]), .B(INQQ[57]), .C(INQ[58]), .D(INQQ[58]), .clock(clock), .OUT(inst237_out));
  CLUSTER_Module_Decoded inst239 (
    .A(INQ[58]), .B(INQQ[58]), .C(INQ[59]), .D(INQQ[59]), .clock(clock), .OUT(inst239_out));
  CLUSTER_Module_Decoded inst240 (
    .A(INQ[59]), .B(INQQ[59]), .C(INQ[60]), .D(INQQ[60]), .clock(clock), .OUT(inst240_out));
  CLUSTER_Module_Decoded inst243 (
    .A(INQ[60]), .B(INQQ[60]), .C(INQ[61]), .D(INQQ[61]), .clock(clock), .OUT(inst243_out));
  CLUSTER_Module_Decoded inst244 (
    .A(INQ[61]), .B(INQQ[61]), .C(INQ[62]), .D(INQQ[62]), .clock(clock), .OUT(inst244_out));
  CLUSTER_Module_Decoded inst246 (
    .A(INQ[62]), .B(INQQ[62]), .C(INQ[63]), .D(INQQ[63]), .clock(clock), .OUT(inst246_out));
  CLUSTER_Module_Decoded inst247 (
    .A(INQ[63]), .B(INQQ[63]), .C(INQ[64]), .D(INQQ[64]), .clock(clock), .OUT(inst247_out));
  CL_SUM2_BL inst (.IN1(inst7_out), .IN2(inst11_out), .clock(clock), .OUT(inst_out));
  CL_SUM2_BL inst1 (.IN1(inst16_out), .IN2(inst21_out), .clock(clock), .OUT(inst1_out));
  CL_SUM2_BL inst3 (.IN1(inst26_out), .IN2(inst31_out), .clock(clock), .OUT(inst3_out));
  CL_SUM2_BL inst4 (.IN1(inst36_out), .IN2(inst41_out), .clock(clock), .OUT(inst4_out));
  CL_SUM2_BL inst58 (.IN1(inst47_out), .IN2(inst48_out), .clock(clock), .OUT(inst58_out));
  CL_SUM2_BL inst51 (.IN1(inst49_out), .IN2(inst50_out), .clock(clock), .OUT(inst51_out));
  CL_SUM2_BL inst55 (.IN1(inst53_out), .IN2(inst54_out), .clock(clock), .OUT(inst55_out));
  CL_SUM2_BL inst59 (.IN1(inst56_out), .IN2(inst57_out), .clock(clock), .OUT(inst59_out));
  CL_SUM2_BL inst73 (.IN1(inst63_out), .IN2(inst69_out), .clock(clock), .OUT(inst73_out));
  CL_SUM2_BL inst84 (.IN1(inst75_out), .IN2(inst80_out), .clock(clock), .OUT(inst84_out));
  CL_SUM2_BL inst96 (.IN1(inst87_out), .IN2(inst92_out), .clock(clock), .OUT(inst96_out));
  CL_SUM2_BL inst107 (.IN1(inst98_out), .IN2(inst103_out), .clock(clock), .OUT(inst107_out));
  CL_SUM2_BL inst112 (.IN1(inst110_out), .IN2(inst111_out), .clock(clock), .OUT(inst112_out));
  CL_SUM2_BL inst115 (.IN1(inst113_out), .IN2(inst114_out), .clock(clock), .OUT(inst115_out));
  CL_SUM2_BL inst119 (.IN1(inst117_out), .IN2(inst118_out), .clock(clock), .OUT(inst119_out));
  CL_SUM2_BL inst122 (.IN1(inst120_out), .IN2(inst121_out), .clock(clock), .OUT(inst122_out));
  CL_SUM2_BL inst136 (.IN1(inst127_out), .IN2(inst132_out), .clock(clock), .OUT(inst136_out));
  CL_SUM2_BL inst147 (.IN1(inst138_out), .IN2(inst143_out), .clock(clock), .OUT(inst147_out));
  CL_SUM2_BL inst159 (.IN1(inst150_out), .IN2(inst155_out), .clock(clock), .OUT(inst159_out));
  CL_SUM2_BL inst170 (.IN1(inst161_out), .IN2(inst166_out), .clock(clock), .OUT(inst170_out));
  CL_SUM2_BL inst175 (.IN1(inst173_out), .IN2(inst174_out), .clock(clock), .OUT(inst175_out));
  CL_SUM2_BL inst178 (.IN1(inst176_out), .IN2(inst177_out), .clock(clock), .OUT(inst178_out));
  CL_SUM2_BL inst182 (.IN1(inst180_out), .IN2(inst181_out), .clock(clock), .OUT(inst182_out));
  CL_SUM2_BL inst185 (.IN1(inst183_out), .IN2(inst184_out), .clock(clock), .OUT(inst185_out));
  CL_SUM2_BL inst199 (.IN1(inst190_out), .IN2(inst195_out), .clock(clock), .OUT(inst199_out));
  CL_SUM2_BL inst210 (.IN1(inst201_out), .IN2(inst206_out), .clock(clock), .OUT(inst210_out));
  CL_SUM2_BL inst222 (.IN1(inst213_out), .IN2(inst218_out), .clock(clock), .OUT(inst222_out));
  CL_SUM2_BL inst233 (.IN1(inst224_out), .IN2(inst229_out), .clock(clock), .OUT(inst233_out));
  CL_SUM2_BL inst238 (.IN1(inst236_out), .IN2(inst237_out), .clock(clock), .OUT(inst238_out));
  CL_SUM2_BL inst241 (.IN1(inst239_out), .IN2(inst240_out), .clock(clock), .OUT(inst241_out));
  CL_SUM2_BL inst245 (.IN1(inst243_out), .IN2(inst244_out), .clock(clock), .OUT(inst245_out));
  CL_SUM2_BL inst248 (.IN1(inst246_out), .IN2(inst247_out), .clock(clock), .OUT(inst248_out));
  CL_SUM3_BL inst2 (.IN1(inst_out), .IN2(inst1_out), .clock(clock), .OUT(inst2_out));
  CL_SUM3_BL inst45 (.IN1(inst3_out), .IN2(inst4_out), .clock(clock), .OUT(inst45_out));
  CL_SUM3_BL inst52 (.IN1(inst58_out), .IN2(inst51_out), .clock(clock), .OUT(inst52_out));
  CL_SUM3_BL inst60 (.IN1(inst55_out), .IN2(inst59_out), .clock(clock), .OUT(inst60_out));
  CL_SUM3_BL inst85 (.IN1(inst73_out), .IN2(inst84_out), .clock(clock), .OUT(inst85_out));
  CL_SUM3_BL inst108 (.IN1(inst96_out), .IN2(inst107_out), .clock(clock), .OUT(inst108_out));
  CL_SUM3_BL inst116 (.IN1(inst112_out), .IN2(inst115_out), .clock(clock), .OUT(inst116_out));
  CL_SUM3_BL inst123 (.IN1(inst119_out), .IN2(inst122_out), .clock(clock), .OUT(inst123_out));
  CL_SUM3_BL inst148 (.IN1(inst136_out), .IN2(inst147_out), .clock(clock), .OUT(inst148_out));
  CL_SUM3_BL inst171 (.IN1(inst159_out), .IN2(inst170_out), .clock(clock), .OUT(inst171_out));
  CL_SUM3_BL inst179 (.IN1(inst175_out), .IN2(inst178_out), .clock(clock), .OUT(inst179_out));
  CL_SUM3_BL inst186 (.IN1(inst182_out), .IN2(inst185_out), .clock(clock), .OUT(inst186_out));
  CL_SUM3_BL inst211 (.IN1(inst199_out), .IN2(inst210_out), .clock(clock), .OUT(inst211_out));
  CL_SUM3_BL inst234 (.IN1(inst222_out), .IN2(inst233_out), .clock(clock), .OUT(inst234_out));
  CL_SUM3_BL inst242 (.IN1(inst238_out), .IN2(inst241_out), .clock(clock), .OUT(inst242_out));
  CL_SUM3_BL inst249 (.IN1(inst245_out), .IN2(inst248_out), .clock(clock), .OUT(inst249_out));
  CL_SUM4_BL inst46 (.IN1(inst2_out), .IN2(inst45_out), .clock(clock), .OUT(inst46_out));
  CL_SUM4_BL inst61 (.IN1(inst52_out), .IN2(inst60_out), .clock(clock), .OUT(inst61_out));
  CL_SUM4_BL inst109 (.IN1(inst85_out), .IN2(inst108_out), .clock(clock), .OUT(inst109_out));
  CL_SUM4_BL inst124 (.IN1(inst116_out), .IN2(inst123_out), .clock(clock), .OUT(inst124_out));
  CL_SUM4_BL inst172 (.IN1(inst148_out), .IN2(inst171_out), .clock(clock), .OUT(inst172_out));
  CL_SUM4_BL inst187 (.IN1(inst179_out), .IN2(inst186_out), .clock(clock), .OUT(inst187_out));
  CL_SUM4_BL inst235 (.IN1(inst211_out), .IN2(inst234_out), .clock(clock), .OUT(inst235_out));
  CL_SUM4_BL inst250 (.IN1(inst242_out), .IN2(inst249_out), .clock(clock), .OUT(inst250_out));
  CL_SUM5_BL inst65 (.IN1(inst46_out), .IN2(inst61_out), .clock(clock), .OUT(inst65_out));
  CL_SUM5_BL inst125 (.IN1(inst109_out), .IN2(inst124_out), .clock(clock), .OUT(inst125_out));
  CL_SUM5_BL inst188 (.IN1(inst172_out), .IN2(inst187_out), .clock(clock), .OUT(inst188_out));
  CL_SUM5_BL inst251 (.IN1(inst235_out), .IN2(inst250_out), .clock(clock), .OUT(inst251_out));
  CL_SUM6_BL inst255 (.IN1(inst188_out), .IN2(inst251_out), .clock(clock), .OUT(inst255_out));
  CL_SUM6_BL inst254 (.IN1(inst65_out), .IN2(inst125_out), .clock(clock), .OUT(inst254_out));
  CL_SUM7_BL inst256 (.IN1(inst254_out), .IN2(inst255_out), .clock(clock), .OUT(OUT));

  // Notes on the sheet:
  //   clock
  //   clock
  //   clock
  //   clock
endmodule
